# EasyEDA Pro project ProPrj_Smart_Screen_T113_end_2025-07-25.epro, board PCB
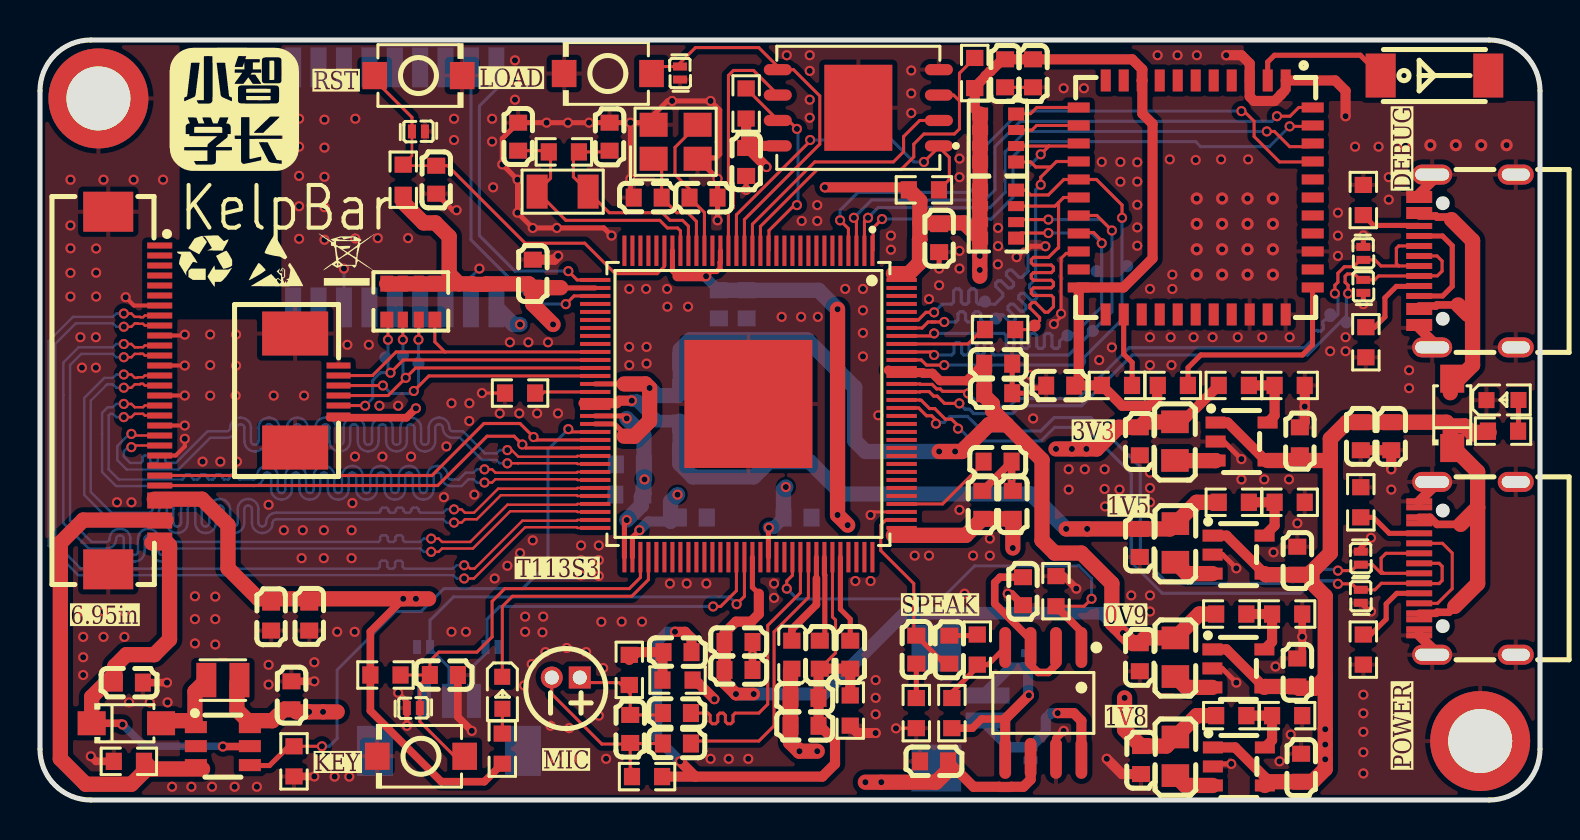
[diagram p7: board, top side]
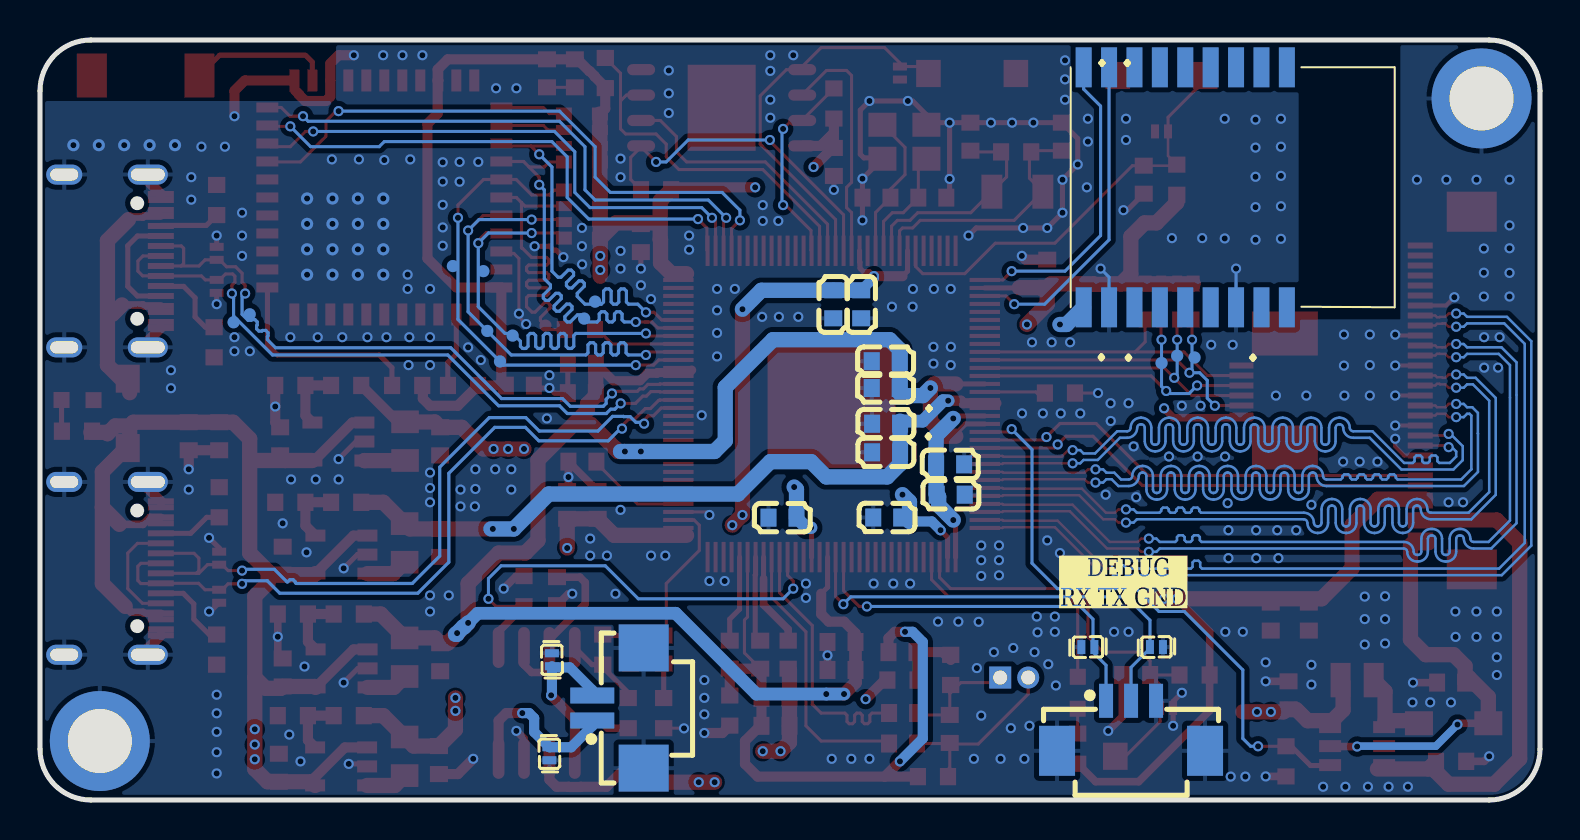
[diagram p8: board, bottom side, seen from below]

Outline 75 x 38 mm; copper layers: Top Layer, GND, VCC, Bottom Layer. Coordinates in mm from the lower left corner of the outline.
Outline path: 0,35.46 0,2.54 arc(0.74,0.74) 2.54,0 72.46,0 arc(74.26,0.74) 75,2.54 75,35.46 arc(74.26,37.26) 72.46,38 2.54,38 arc(0.74,37.26) 0,35.46
Stack: Top Layer 0.035mm 外层铜厚1oz / Dielectric1 0.2104mm 7628 RC49% 8.6mil / GND 0.0152mm 内层铜厚 / Dielectric2 1.065mm 1.1mm H/HOZ Copper / VCC 0.0152mm 内层铜厚 / Dielectric3 0.2104mm 7628 RC49% 8.6mil / Bottom Layer 0.035mm 外层铜厚1oz

## Design rules (mm)
net MIC_IN_3P: DP8
net MIC_IN_3N: DP8
net USB1_DP: DP1
net USB1_DM: DP1
net USB0_DM: DP2
net USB0_DP: DP2
net LCD_CLK_P: DP3
net LCD_CLK_N: DP3
net MIPI_0_P: DP10
net MIPI_0_N: DP10
net MIPI_1_P: DP11
net MIPI_1_N: DP11
net MIPI_2_P: DP12
net MIPI_2_N: DP12
net MIPI_3_P: DP13
net MIPI_3_N: DP13
template: 自定义配置
spacing copperThickness1oz (default): track to track 0.102, other pairs 0.152 to 0.3
spacing copperThickness2oz: track to track 0.203, other pairs 0.152 to 0.3
track width copperThickness1oz (default): min 0.127, default 0.254, max 2.54
track width copperThickness2oz: min 0.203, default 0.254, max 2.54
track width 3313_50ohm_单端: min 0.157, default 0.157, max 0.157
differential pair differentialPair (default): width min 0.127, default 0.127, max 2.54; gap min 0.152, default 0.203
differential pair 3313_100ohm_差分: width min 0.124, default 0.124, max 0.124; gap min 0.203, default 0.203
differential pair 3313_90ohm_差分: width min 0.157, default 0.157, max 0.157; gap min 0.203, default 0.203
via viaSize (default): diameter min 0.5, default 0.61, max 10; hole min 0.3, default 0.305, max 6.299
net WL_SDIO_D1 uses 3313_50ohm_单端
net WL_SDIO_D0 uses 3313_50ohm_单端
net WL_SDIO_CMD uses 3313_50ohm_单端
net WL_SDIO_D3 uses 3313_50ohm_单端
net WL_SDIO_D2 uses 3313_50ohm_单端
net WL_SDIO_CLK uses 3313_50ohm_单端
net USB1_DP uses 3313_90ohm_差分
net USB1_DM uses 3313_90ohm_差分
net USB0_DM uses 3313_90ohm_差分
net USB0_DP uses 3313_90ohm_差分
net LCD_CLK_P uses 3313_100ohm_差分
net LCD_CLK_N uses 3313_100ohm_差分
net MIPI_LCD_RST uses 3313_50ohm_单端
net MIPI_LCD_TE uses 3313_50ohm_单端
net MIPI_0_P uses 3313_100ohm_差分
net MIPI_0_N uses 3313_100ohm_差分
net MIPI_1_P uses 3313_100ohm_差分
net MIPI_1_N uses 3313_100ohm_差分
net MIPI_2_P uses 3313_100ohm_差分
net MIPI_2_N uses 3313_100ohm_差分
net MIPI_3_P uses 3313_100ohm_差分
net MIPI_3_N uses 3313_100ohm_差分
diff pair DP1 uses 3313_90ohm_差分
diff pair DP2 uses 3313_90ohm_差分
diff pair DP3 uses 3313_100ohm_差分
diff pair DP10 uses 3313_100ohm_差分
diff pair DP11 uses 3313_100ohm_差分
diff pair DP12 uses 3313_100ohm_差分
diff pair DP13 uses 3313_100ohm_差分

## Placement (name value [footprint] x y rotation side)
C1  100nF  [C0603]  35.31 31.9 270 top
C9  10uF  [C0603]  34.92 6.5 180 top
C12  100nF  [C0603]  34.92 7.9 180 top
C13  10uF  [C0603]  32.7 18.82 180 bottom
C14  100nF  [C0603]  32.7 17.38 180 bottom
C15  100nF  [C0603]  37.88 14.12 180 bottom
C16  100nF  [C0603]  32.64 14.12 180 bottom
C17  100nF  [C0603]  24.64 26.32 270 top
C19  100nF  [C0603]  44.96 28.09 90 top
C21  100nF  [C0603]  35.34 24.78 90 bottom
C27  10uF  [C0603]  32.71 20.6 180 bottom
C28  10uF  [C0603]  47.91 20.34 180 top
C29  100nF  [C0603]  32.71 21.94 180 bottom
C30  100nF  [C0603]  47.91 21.81 180 top
C31  10uF  [C0603]  38.23 5.11 180 top
C33  10uF  [C0603]  48.64 14.76 270 top
C34  100nF  [C0603]  47.12 14.76 270 top
C36  100nF  [C0603]  29.49 16.78 0 bottom
C37  100nF  [C0603]  29.46 15.27 0 bottom
C38  100nF  [C0603]  33.94 24.78 90 bottom
C41  100nF  [C0603]  19.81 31.02 90 top
C63  100nF  [C0603]  48.25 36.33 90 top
C64  10uF  [C0603]  49.65 36.33 90 top
C65  10uF  [C0603]  51.01 20.72 0 top
C82  470nF  [C0603]  40.51 7.27 270 top
C83  470nF  [C0603]  38.99 7.27 270 top
C85  100nF  [C0603]  31.85 4.35 0 top
C86  100nF  [C0603]  31.85 2.82 0 top
C87  100pF  [C0603]  29.51 3.55 90 top
C88  2.2uF  [C0603]  38.23 3.71 180 top
C91  100nF  [C0603]  47.88 16.92 180 top
C107  10uF  [C0603]  62.99 17.93 270 top
C108  10uF  [C0603]  54.99 17.93 90 top
C109  10uF  [C0603]  62.86 11.96 270 top
C110  10uF  [C0603]  54.99 12.85 90 top
C111  10uF  [C0603]  62.86 6.38 270 top
C112  10uF  [C0603]  54.99 7.14 90 top
C115  10uF  [C0603]  67.56 18.19 90 top
C116  100nF  [C0603]  66.04 18.19 90 top
C119  1uF  [C0603]  4.45 5.87 180 top
C120  12pF  [C0603]  28.48 33.17 90 top
C121  12pF  [C0603]  23.91 33.17 270 top
C122  12pF  [C0603]  30.38 30.12 0 top
C123  12pF  [C0603]  33.18 30.12 180 top
C124  100nF  [C0603]  20.19 6.25 180 top
C132  22uF  [C0603]  13.46 9.17 270 top
C133  1uF  [C0603]  11.56 9.17 90 top
C135  100nF  [C0603]  43.82 7.52 270 top
C138  1uF  [C0603]  49.15 10.44 90 top
C139  10uF  [C0603]  44.7 1.93 0 top
C141  1uF  [C0603]  12.57 5.23 270 top
C142  470nF  [C0603]  45.47 7.52 90 top
C143  10uF  [C0603]  31.88 7.39 0 top
C144  10uF  [C0603]  63.06 1.61 270 top
C145  10uF  [C0603]  55.05 2 90 top
CN2  HC-1.25-2PWT  [CONN-SMD_2P-P1.25-HC-1.25-2PWT]  46.1 4.6 90 bottom
D22  LMBR240FT1G  [SOD-123FL_L2.7-W1.8-LS3.8-RD]  4.32 3.84 0 top
D23  LMBR240FT1G  [SOD-123FL_L2.7-W1.8-LS3.8-RD]  70.61 19.33 90 top
FPC2  FPC-05F-30PH20  [FPC-SMD_30P-P0.50_XUNPU_FPC-05F-30PH20]  4.7 20.47 270 top
FPC7  AFC07-S06ECA-00  [FPC-SMD_P0.50-6P_LCS-SJ-H2.0]  13.84 20.47 90 top
L8  GZ1608D601TF  [L0603]  37.59 7.27 270 top
L10  AN2051-245  [ANT2051]  69.72 36.22 0 top
L18  10uH  [IND-SMD_L2.0-W1.6]  9.14 6 0 top
L20  2.2uH  [L0805]  56.75 17.94 90 top
L21  2.2uH  [L0805]  56.77 12.85 90 top
L22  2.2uH  [L0805]  56.77 2.19 90 top
L23  2.2uH  [L0805]  56.77 7.14 90 top
LED3  NCD0603B1  [LED0603-RD]  73.12 20 0 top
LED4  NCD0603B1  [LED0603-RD]  23.11 5.36 270 top
MIC2  GMI4015P-2C-42db  [MIC-TH_BD4.0-P1.40-D0.4-L-FD]  26.29 6.12 180 top
NOREF  -  [Pad_e3763]  52 21.93 0 top
NOREF#2  -  [Pad_e3756]  51.37 23.22 0 top
NOREF#3  -  [Pad_e3754]  47.24 24.92 0 top
NOREF#4  -  [Pad_e1455]  65.32 23.89 0 top
NOREF#5  -  [Pad_e1457]  52.83 26.44 0 top
NOREF#6  -  [Pad_e3755]  47.79 24.07 0 top
NOREF#7  -  [Pad_e1458]  17.27 22.12 0 top
NOREF#8  -  [Pad_e3757]  52.64 23.45 0 top
NOREF#9  -  [Pad_e1465]  18.92 21.85 0 top
NOREF#10  -  [Pad_e3765]  49.73 23.72 0 top
NOREF#11  -  [Pad_e1456]  54.36 26.7 0 top
NOREF#12  -  [Pad_e1459]  18.14 22.21 0 top
NOREF#13  -  [Pad_e12602]  72.01 2.95 180 top
NOREF#14  -  [Pad_e1454]  64.52 24.28 0 top
NOREF#15  -  [Pad_e12601]  2.92 35.08 180 top
R13  10kΩ  [R0603]  18.16 31.02 270 top
R14  10MΩ  [R0603]  26.19 32.4 0 top
R52  10kΩ  [R0603]  56.64 20.73 180 top
R79  0Ω  [R0603]  40.51 4.47 90 top
R90  33Ω  [R0603]  48.01 23.52 0 top
R91  10kΩ  [R0603]  53.85 20.73 180 top
R93  10kΩ  [R0603]  35.31 34.83 270 top
R107  150kΩ  [R0603]  62.48 20.73 180 top
R108  680kΩ  [R0603]  59.69 20.73 180 top
R109  300kΩ  [R0603]  59.69 14.89 180 top
R110  150kΩ  [R0603]  59.56 9.3 180 top
R111  200kΩ  [R0603]  62.48 14.89 180 top
R112  300kΩ  [R0603]  62.36 9.3 180 top
R113  5.1kΩ  [R0603]  66.17 7.52 90 top
R114  5.1kΩ  [R0603]  66.04 14.89 90 top
R115  10kΩ  [R0603]  73.15 18.44 0 top
R120  10kΩ  [R0603]  12.7 1.93 90 top
R121  10Ω  [R0603]  4.45 1.93 0 top
R122  10kΩ  [R0603]  44.2 30.51 180 top
R123  240Ω  [R0603]  24 20.35 0 top
R124  10kΩ  [R0603]  23.11 2.57 90 top
R126  10kΩ  [R0603]  17.27 6.25 180 top
R135  22Ω  [R0603]  43.82 4.34 90 top
R136  20kΩ  [R0603]  46.86 7.52 270 top
R138  100kΩ  [R0603]  50.8 10.44 270 top
R141  5.1kΩ  [R0603]  66.29 22.89 90 top
R142  5.1kΩ  [R0603]  66.17 30 90 top
R145  10kΩ  [R0603]  46.74 36.35 90 top
R146  1kΩ  [R0603]  30.35 1.17 180 top
R147  1kΩ  [R0603]  29.46 6.5 90 top
R148  75Ω  [R0603]  31.88 6 0 top
R149  20kΩ  [R0603]  45.59 4.34 270 top
R152  150kΩ  [R0603]  62.36 4.22 180 top
R153  300kΩ  [R0603]  59.56 4.22 180 top
RN1  10kΩ  [RES-ARRAY-SMD_0603-8P-L3.2-W1.6-BL]  18.54 24.92 0 top
RN2  10kΩ  [RES-ARRAY-SMD_0603-8P-L3.2-W1.6-BL]  47.9 33.1 90 top
RN3  10kΩ  [RES-ARRAY-SMD_0603-8P-L3.2-W1.6-BL]  47.9 29.29 90 top
SW1  TS-1088-AR02016  [SW-SMD_L3.9-W3.0-P4.45]  28.39 36.32 180 top
SW2  TS-1088-AR02016  [SW-SMD_L3.9-W3.0-P4.45]  18.92 36.22 0 top
SW5  TS-1088-AR02016  [SW-SMD_L3.9-W3.0-P4.45]  19.05 2.19 180 top
T1  T113_S3  [TQFP-128_L14.0-W14.0-P0.40-LS16.0-BL-EP6.4]  35.42 19.8 180 top
U1  W25N01GVZEIG  [WSON-8_L8.0-W6.10-P1.27-BL-EP]  40.92 34.61 90 top
U5  -  [MX02]  23.5 24.66 180 bottom
U11  RTL8723DS模块  [WIFIM-SMD_44P-L12.0-W12.0-P0.90_RTL8723DS]  57.79 30.13 270 top
U21  ESD5451N  [X1-DFN1006-2_L1.0-W0.6-P0.65-BI]  32 36.35 270 top
U24  ZX-MX1.25-3PWT  [CONN-SMD_3P-P1.25_MEGASTAR_ZX-MX1.25-3PWT]  20.45 3.71 180 bottom
U27  SY8088AAC  [SOT-23-5_L3.0-W1.7-P0.95-LS2.8-BR]  60.08 17.92 180 top
U28  SY8088AAC  [SOT-23-5_L3.0-W1.7-P0.95-LS2.8-BR]  59.93 12.27 180 top
U29  SY8088AAC  [SOT-23-5_L3.0-W1.7-P0.95-LS2.8-BR]  59.92 6.58 180 top
U33  ESD5451N  [X1-DFN1006-2_L1.0-W0.6-P0.65-BI]  66.17 27.33 270 top
U34  ESD5451N  [X1-DFN1006-2_L1.0-W0.6-P0.65-BI]  66.17 25.68 270 top
U35  ESD5451N  [X1-DFN1006-2_L1.0-W0.6-P0.65-BI]  66.04 10.19 90 top
U36  ESD5451N  [X1-DFN1006-2_L1.0-W0.6-P0.65-BI]  66.04 12.09 270 top
U37  ESD5451N  [X1-DFN1006-2_L1.0-W0.6-P0.65-BI]  19.18 7.65 0 bottom
U38  ESD5451N  [X1-DFN1006-2_L1.0-W0.6-P0.65-BI]  22.61 7.65 0 bottom
U41  ESD5451N  [X1-DFN1006-2_L1.0-W0.6-P0.65-BI]  18.92 33.43 180 top
U42  ESD5451N  [X1-DFN1006-2_L1.0-W0.6-P0.65-BI]  18.67 4.6 0 top
U49  ESD5451N  [X1-DFN1006-2_L1.0-W0.6-P0.65-BI]  49.4 7.01 270 bottom
U50  ESD5451N  [X1-DFN1006-2_L1.0-W0.6-P0.65-BI]  49.53 2.31 90 bottom
U52  MT9201  [SOT-23-6_L2.9-W1.6-P0.95-LS2.8-BR]  9.14 2.69 180 top
U53  LM4871  [SOIC-8_L4.9-W3.9-P1.27-LS6.0-BL]  50.17 4.85 180 top
U54  SY8088AAC  [SOT-23-5_L3.0-W1.7-P0.95-LS2.8-BR]  59.94 1.68 180 top
USB9  KH-TYPE-C-16P  [usb-c-smd_kh-type-c-16p]  71.37 11.58 90 top
USB10  KH-TYPE-C-16P  [usb-c-smd_kh-type-c-16p]  71.37 26.95 90 top
X1  XL2EL89COI-111YLC-24M  [CRYSTAL-SMD_4P-L3.2-W2.5-BL]  31.78 32.91 0 top
X2  32.768kHz  [OSC-SMD_L3.2-W1.5]  26.13 30.42 180 top

## Footprints (pads in the part's own frame, mm; a bottom-side part is the same pattern mirrored in y, then rotated)
ANT2051
  rect 1.5x2.2 smd: 1(-2.69,0) 2(2.69,0)
C0603
  rect 0.8x0.9 smd: 1(-0.7,0) 2(0.7,0)
CONN-SMD_2P-P1.25-HC-1.25-2PWT
  rect 0.8x2.2 smd: 1(-0.625,1.285) 2(0.625,1.285)
  rect 2.35x2.5 smd: 3(-3.005,-1.285) 4(3.005,-1.285)
CONN-SMD_3P-P1.25_MEGASTAR_ZX-MX1.25-3PWT
  rect 0.7x1.7 smd: 1(-1.25,1.25) 2(0,1.25) 3(1.25,1.25)
  rect 1.8x2.5 smd: 4(-3.7,-1.25) 5(3.7,-1.25)
CRYSTAL-SMD_4P-L3.2-W2.5-BL
  rect 1.4x1.2 smd: 1(-1.1,-0.85) 2(1.1,-0.85) 3(1.1,0.85) 4(-1.1,0.85)
FPC-SMD_30P-P0.50_XUNPU_FPC-05F-30PH20
  rect 0.3x1.25 smd: 1(-7.25,1.288) 2(-6.75,1.288) 3(-6.25,1.288) 4(-5.75,1.288) 5(-5.25,1.288) 6(-4.75,1.288) 7(-4.25,1.288) 8(-3.75,1.288) 9(-3.25,1.288) 10(-2.75,1.288) 11(-2.25,1.288) 12(-1.75,1.288) 13(-1.25,1.288) 14(-0.75,1.288) 15(-0.25,1.288) 16(0.25,1.288) 17(0.75,1.288) 18(1.25,1.288) 19(1.75,1.288) 20(2.25,1.288) 21(2.75,1.288) 22(3.25,1.288) 23(3.75,1.288) 24(4.25,1.288) 25(4.75,1.288) 26(5.25,1.288) 27(5.75,1.288) 28(6.25,1.288) 29(6.75,1.288) 30(7.25,1.288)
  rect 2x2.5 smd: 31(8.94,-1.288) 32(-8.94,-1.288)
FPC-SMD_P0.50-6P_LCS-SJ-H2.0
  rect 0.3x1.2 smd: 1(1.25,-1.085) 2(0.75,-1.085) 3(0.25,-1.085) 4(-0.25,-1.085) 5(-0.75,-1.085) 6(-1.25,-1.085)
  rect 2.2x3.3 smd: 7(2.85,1.085) 8(-2.85,1.085)
IND-SMD_L2.0-W1.6
  rect 1x1.72 smd: 1(0.828,0) 2(-0.828,0)
L0603
  rect 0.8x0.864 smd: 1(-0.7,0) 2(0.7,0)
L0805
  rect 1.133x1.377 smd: 1(-0.966,0) 2(0.966,0)
LED0603-RD
  rect 0.8x0.8 smd: 1(-0.799,-0.004) 2(0.799,0.004)
MIC-TH_BD4.0-P1.40-D0.4-L-FD
  rect 1.1x1.1 hole 0.7: 1(-0.7,0)
  round 1.1 hole 0.7: 2(0.7,0)
MX02
  rect 0.8x2 smd: 1(10.838,11.969) 2(9.568,11.969) 3(8.298,11.969) 4(7.028,11.969) 5(5.758,11.969) 6(4.488,11.969) 7(3.218,11.969) 8(1.948,11.969) 9(0.678,11.969) 10(0.678,-0.031) 11(1.948,-0.031) 12(3.218,-0.031) 13(4.488,-0.031) 14(5.758,-0.031) 15(7.028,-0.031) 16(8.298,-0.031) 17(9.568,-0.031) 18(10.838,-0.031)
OSC-SMD_L3.2-W1.5
  rect 1.05x1.7 smd: 1(-1.275,0) 2(1.275,0)
Pad_e1454
  round 0.61 smd far side: TP1(0,0)
Pad_e1455
  round 0.61 smd far side: TP2(0,0)
Pad_e1456
  round 0.61 smd far side: TP3(0,0)
Pad_e1457
  round 0.61 smd far side: TP4(0,0)
Pad_e1458
  round 0.61 smd far side: TP5(0,0)
Pad_e1459
  round 0.61 smd far side: TP6(0,0)
Pad_e1465
  round 0.61 smd far side: TP7(0,0)
Pad_e3754
  round 0.61 smd far side: TP22(0,0)
Pad_e3755
  round 0.61 smd far side: TP23(0,0)
Pad_e3756
  round 0.61 smd far side: TP24(0,0)
Pad_e3757
  round 0.61 smd far side: TP25(0,0)
Pad_e3763
  round 0.61 smd far side: TP26(0,0)
Pad_e3765
  round 0.61 smd: TP27(0,0)
Pad_e12601
  round 5 hole 3.2: 1(0,0)
Pad_e12602
  round 5 hole 3.2: 1(0,0)
R0603
  rect 0.806x0.864 smd: 1(-0.753,0) 2(0.753,0)
RES-ARRAY-SMD_0603-8P-L3.2-W1.6-BL
  rect 0.65x0.8 smd: 1(-1.2,-0.9) 4(1.2,-0.9) 5(1.2,0.9) 8(-1.2,0.9)
  rect 0.5x0.8 smd: 2(-0.4,-0.9) 3(0.4,-0.9) 6(0.4,0.9) 7(-0.4,0.9)
SOD-123FL_L2.7-W1.8-LS3.8-RD
  rect 1.4x1.2 smd: 1(-1.735,0) 2(1.735,0)
SOIC-8_L4.9-W3.9-P1.27-LS6.0-BL
  oval 0.588x2.045 smd: 1(-1.905,-2.772) 2(-0.635,-2.772) 3(0.635,-2.772) 4(1.905,-2.772) 5(1.905,2.772) 6(0.635,2.772) 7(-0.635,2.772) 8(-1.905,2.772)
SOT-23-5_L3.0-W1.7-P0.95-LS2.8-BR
  rect 1x0.6 smd: 1(1.3,-0.95) 2(1.3,0) 3(1.3,0.95) 4(-1.3,0.95) 5(-1.3,-0.95)
SOT-23-6_L2.9-W1.6-P0.95-LS2.8-BR
  rect 1.1x0.6 smd: 1(1.35,-0.95) 2(1.35,0) 3(1.35,0.95) 4(-1.35,0.95) 5(-1.35,0) 6(-1.35,-0.95)
SW-SMD_L3.9-W3.0-P4.45
  rect 1.23x1.36 smd: 1(-2.185,0) 2(2.185,0)
TQFP-128_L14.0-W14.0-P0.40-LS16.0-BL-EP6.4
  rect 0.2x1.52 smd: 1(-6.2,-7.66) 2(-5.8,-7.66) 3(-5.4,-7.66) 4(-5,-7.66) 5(-4.6,-7.66) 6(-4.2,-7.66) 7(-3.8,-7.66) 8(-3.4,-7.66) 9(-3,-7.66) 10(-2.6,-7.66) 11(-2.2,-7.66) 12(-1.8,-7.66) 13(-1.4,-7.66) 14(-1,-7.66) 15(-0.6,-7.66) 16(-0.2,-7.66) 17(0.2,-7.66) 18(0.6,-7.66) 19(1,-7.66) 20(1.4,-7.66) 21(1.8,-7.66) 22(2.2,-7.66) 23(2.6,-7.66) 24(3,-7.66) 25(3.4,-7.66) 26(3.8,-7.66) 27(4.2,-7.66) 28(4.6,-7.66) 29(5,-7.66) 30(5.4,-7.66) 31(5.8,-7.66) 32(6.2,-7.66) 65(6.2,7.66) 66(5.8,7.66) 67(5.4,7.66) 68(5,7.66) 69(4.6,7.66) 70(4.2,7.66) 71(3.8,7.66) 72(3.4,7.66) 73(3,7.66) 74(2.6,7.66) 75(2.2,7.66) 76(1.8,7.66) 77(1.4,7.66) 78(1,7.66) 79(0.6,7.66) 80(0.2,7.66) 81(-0.2,7.66) 82(-0.6,7.66) 83(-1,7.66) 84(-1.4,7.66) 85(-1.8,7.66) 86(-2.2,7.66) 87(-2.6,7.66) 88(-3,7.66) 89(-3.4,7.66) 90(-3.8,7.66) 91(-4.2,7.66) 92(-4.6,7.66) 93(-5,7.66) 94(-5.4,7.66) 95(-5.8,7.66) 96(-6.2,7.66)
  rect 1.52x0.2 smd: 33(7.66,-6.2) 34(7.66,-5.8) 35(7.66,-5.4) 36(7.66,-5) 37(7.66,-4.6) 38(7.66,-4.2) 39(7.66,-3.8) 40(7.66,-3.4) 41(7.66,-3) 42(7.66,-2.6) 43(7.66,-2.2) 44(7.66,-1.8) 45(7.66,-1.4) 46(7.66,-1) 47(7.66,-0.6) 48(7.66,-0.2) 49(7.66,0.2) 50(7.66,0.6) 51(7.66,1) 52(7.66,1.4) 53(7.66,1.8) 54(7.66,2.2) 55(7.66,2.6) 56(7.66,3) 57(7.66,3.4) 58(7.66,3.8) 59(7.66,4.2) 60(7.66,4.6) 61(7.66,5) 62(7.66,5.4) 63(7.66,5.8) 64(7.66,6.2) 97(-7.66,6.2) 98(-7.66,5.8) 99(-7.66,5.4) 100(-7.66,5) 101(-7.66,4.6) 102(-7.66,4.2) 103(-7.66,3.8) 104(-7.66,3.4) 105(-7.66,3) 106(-7.66,2.6) 107(-7.66,2.2) 108(-7.66,1.8) 109(-7.66,1.4) 110(-7.66,1) 111(-7.66,0.6) 112(-7.66,0.2) 113(-7.66,-0.2) 114(-7.66,-0.6) 115(-7.66,-1) 116(-7.66,-1.4) 117(-7.66,-1.8) 118(-7.66,-2.2) 119(-7.66,-2.6) 120(-7.66,-3) 121(-7.66,-3.4) 122(-7.66,-3.8) 123(-7.66,-4.2) 124(-7.66,-4.6) 125(-7.66,-5) 126(-7.66,-5.4) 127(-7.66,-5.8) 128(-7.66,-6.2)
  rect 6.4x6.4 smd: 129(0,0)
usb-c-smd_kh-type-c-16p
  oval 1x2 hole 0.6x1.7: 1(-4.32,1.765) 2(4.32,1.765)
  oval 1x1.8 hole 0.6x1.4: 3(-4.32,-2.415) 4(4.32,-2.415)
  rect 0.3x1.3 smd: A1(-3.35,2.415) A4(-2.55,2.415) A5(-1.25,2.415) A6(-0.25,2.415) A7(0.25,2.415) A8(1.25,2.415) A9(2.55,2.415) A12(3.35,2.415) B1(3.05,2.415) B4(2.25,2.415) B5(1.75,2.415) B6(0.75,2.415) B7(-0.75,2.415) B8(-1.75,2.415) B9(-2.25,2.415) B12(-3.05,2.415)
WIFIM-SMD_44P-L12.0-W12.0-P0.90_RTL8723DS
  rect 1.1x0.5 smd: 1(-5.85,4.5) 2(-5.85,3.6) 3(-5.85,2.7) 4(-5.85,1.8) 5(-5.85,0.9) 6(-5.85,0) 7(-5.85,-0.9) 8(-5.85,-1.8) 9(-5.85,-2.7) 10(-5.85,-3.6) 11(-5.85,-4.5) 23(5.85,-4.5) 24(5.85,-3.6) 25(5.85,-2.7) 26(5.85,-1.8) 27(5.85,-0.9) 28(5.85,0) 29(5.85,0.9) 30(5.85,1.8) 31(5.85,2.7) 32(5.85,3.6) 33(5.85,4.5)
  rect 0.5x1.1 smd: 12(-4.5,-5.85) 13(-3.6,-5.85) 14(-2.7,-5.85) 15(-1.8,-5.85) 16(-0.9,-5.85) 17(0,-5.85) 18(0.9,-5.85) 19(1.8,-5.85) 20(2.7,-5.85) 21(3.6,-5.85) 22(4.5,-5.85) 34(4.5,5.85) 35(3.6,5.85) 36(2.7,5.85) 37(1.8,5.85) 38(0.9,5.85) 39(0,5.85) 40(-0.9,5.85) 41(-1.8,5.85) 42(-2.7,5.85) 43(-3.6,5.85) 44(-4.5,5.85)
WSON-8_L8.0-W6.10-P1.27-BL-EP
  oval 0.56x1.4 smd: 1(-1.905,-4.027) 2(-0.635,-4.027) 3(0.635,-4.027) 4(1.905,-4.027) 5(1.905,4.027) 6(0.635,4.027) 7(-0.635,4.027) 8(-1.905,4.027)
  rect 4.3x3.4 smd: 9(0,0)
X1-DFN1006-2_L1.0-W0.6-P0.65-BI
  rect 0.4x0.7 smd: 1(-0.325,0) 2(0.325,0)

## Nets
As in the schematic, except:
GND: C1.2 C9.1 C12.1 C13.1 C14.1 C15.1 C16.1 C17.1 C19.1 C21.1 C27.1 C28.1 C29.1 C30.1 C33.1 C34.1 C36.1 C37.1 C38.1 C41.1 C63.1 C64.1 C65.1 C91.1 C107.1 C108.1 C109.1 C110.1 C111.1 C112.1 C115.1 C116.1 C119.1 C120.2 C121.1 C122.1 C123.1 C124.1 C132.2 C133.1 C138.1 C139.1 C141.1 C144.1 C145.1 CN2.3 CN2.4 FPC2.7 FPC2.10 FPC2.13 FPC2.16 FPC2.19 FPC2.22 FPC2.31 FPC2.32 FPC7.1 FPC7.7 FPC7.8 LED3.1 NOREF#13.1 NOREF#15.1 R79.1 R107.1 R111.1 R112.1 R113.1 R114.2 R120.1 R121.1 R123.1 R135.1 R138.1 R141.1 R142.2 R152.1 SW1.2 SW2.2 SW5.2 T1.99 T1.129 U1.4 U1.9 U5.11 U5.16 U11.1 U11.3 U11.20 U11.31 U11.33 U11.36 U21.2 U24.3 U24.4 U24.5 U27.2 U28.2 U29.2 U33.1 U34.2 U35.1 U36.1 U37.1 U38.2 U41.1 U42.1 U49.1 U50.1 U52.2 U53.7 U54.2 USB9.1 USB9.2 USB9.3 USB9.4 USB9.A1 USB9.A12 USB9.B1 USB9.B12 USB10.1 USB10.2 USB10.3 USB10.4 USB10.A1 USB10.A12 USB10.B1 USB10.B12 X1.2 X1.4
TP_RST: FPC7.5 NOREF#7.TP5 RN1.1 T1.43
TP_SCL: FPC7.4 NOREF#12.TP6 RN1.2 T1.44
TP_SDA: FPC7.3 NOREF#9.TP7 RN1.3 T1.45
USB0_DM: NOREF#4.TP2 T1.114 U34.1 USB10.A7 USB10.B7
USB0_DP: NOREF#14.TP1 T1.115 U33.2 USB10.A6 USB10.B6
WL_SDIO_CMD: NOREF.TP26 NOREF#11.TP3 RN3.4 T1.118 U11.16
WL_SDIO_D0: NOREF#8.TP25 RN3.2 T1.119 U11.18
WL_SDIO_D1: NOREF#2.TP24 NOREF#5.TP4 RN3.1 T1.121 U11.19
WL_SDIO_D2: NOREF#3.TP22 RN2.2 T1.123 U11.14
WL_SDIO_D3: NOREF#6.TP23 RN2.1 T1.122 U11.15
$2N981: NOREF#10.TP27 R90.2 RN3.3 U11.17

Pads without a net: FPC2 1 2 3 4 5 6 23; L10 2; T1 5 6 7 8 9 10 11 12 13 21 28 29 30 31 32 36 37 38 39 40 41 69 70 71 72 73 74 75 76 77 78 82 84 85 93 94 95 96 101 102 103 104 105 106 107 108 109 110 111 124 125 126 127; U5 1 2 3 4 5 6 7 12 13 14 15 17 18; U11 4 5 6 7 8 10 11 21 23 25 26 27 28 29 30 32 35 37 38 39 40; USB9 A8 B8; USB10 A8 B8

## Via types
v1: diameter 0.508, hole 0.305, Top Layer to Bottom Layer, 456 vias
v2: diameter 0.61, hole 0.305, Top Layer to Bottom Layer, 21 vias

## Routing (per net, layer and track width the routed paths; a pad name or vN(x,y) marks a point on that pad's centre or on a via; arc(x,y) is an arc through that point)
0V9: length 92.2
  Top Layer w0.254: 29.15,18.38 28.72,18.8 T1.51 ; T1.81 35.62,10.63 35.94,10.31 ; 29.21,20.8 T1.46
  Top Layer w0.457: C30.2 47.08,21.69 47.06,21.69 46.34,20.96 45,20.96 44.63,21.33 44.15,21.33 44.12,21.37 42.55,21.37 42.42,21.5
  Top Layer w0.508: 35.94,10.31 35.94,9.3 35.56,8.92 34.8,8.92 34.23,8.34 C12.2
  Top Layer w0.635: v1(35.69,5.3) v1(34.8,5.3) 34.23,5.87 C9.2 C12.2
  Top Layer w0.762: 48.33,18.77 47.44,18.77 46.58,17.9 46.56,17.9 46.25,17.59 46.25,17.57 46.1,17.43 v1(45.76,17.43) v1(44.96,17.43) ; 48.33,18.77 47.63,19.48 47.63,19.8 47.21,20.21 ; 48.33,18.77 50.1,17 50.1,12.98 50.74,12.35 52.07,12.35 53.59,10.82 v1(53.59,8.85) 54.61,7.84 C112.2 55.26,8.1 L23.2 57.96,9.3 R110.2 ; C28.2 C30.2 ; 29.21,18.19 29.72,18.19 30.48,18.95 v1(30.48,20.6) 30.28,20.8 29.21,20.8
  Bottom Layer w0.635: v1(53.59,8.85) 53.11,9.34 43.22,9.34 39.18,5.3 v1(35.69,5.3) v1(34.8,5.3)
  Bottom Layer w0.762: v1(53.59,8.85) 53.79,8.66 53.83,8.66 v1(54.14,8.34) 54.14,8.3 54.17,8.28 54.23,8.28 ; 45.97,17.43 v1(44.96,17.43) 41.27,17.43 40.74,17.96 40.74,20.63 38.35,23.01 32.51,23.01 32.01,22.51 C29.2 32.01,20.34 31.89,20.22 30.86,20.22 v1(30.48,20.6)
1V5: length 38
  Top Layer w0.508: v1(29.59,19.97) 28.96,19.97 28.83,19.84 27.18,19.84
  Top Layer w0.762: R109.2 57.83,14.89 56.5,13.55 C110.2 v1(52.36,13.55) v1(51.31,13.55)
  Bottom Layer w0.635: v1(29.59,19.97) 29.85,19.97 30.87,18.94 32,18.94
  Bottom Layer w0.762: 32,18.94 32,16.8 32.64,16.16 35.69,16.16 36.45,16.92 38.48,16.92 40.1,15.3 49.56,15.3 v1(51.31,13.55) 52.45,13.55
1V8: length 103.8
  Top Layer w0.254: 31.62,27.46 31.62,26.44 31.88,26.19 ; v1(29.34,14) 29.22,13.88 T1.65 ; T1.50 29.21,19.2 v1(29.34,19.08) ; v1(33.3,26.19) 33.54,26.42 33.84,26.42 34,26.59 34,26.89 34.02,26.91 T1.20
  Top Layer w0.508: v1(33.72,5.04) 32.66,6.1 32.5,6.1 ; 31.88,26.19 v1(33.3,26.19)
  Top Layer w0.762: v1(38.86,2.44) v1(37.97,2.44) 37.53,2.89 C88.2 C31.2 37.53,6.5 L8.2 ; v1(40.39,13.74) v1(39.88,14.25) v1(39.88,24.54) ; R153.2 57.83,4.22 56.31,2.7 C145.2 54.23,3.52 v1(54.23,4.46) v1(54.23,5.11) ; 42.67,13.23 46.29,13.23 C34.2 C33.2 v1(48.64,12.6)
  VCC w0.508: v1(37.97,2.44) 36.32,2.44 v1(33.72,5.04)
  VCC w0.762: 43.18,10.95 43.43,11.2 48.17,11.2 48.85,11.88 ; 43.18,10.95 40.89,8.66 40.89,3.39 39.94,2.44 v1(38.86,2.44) v1(37.97,2.44) ; 43.18,10.95 v1(40.39,13.74) v1(39.88,14.25) 39.62,14.5 32.64,14.5 32,13.87 30.73,13.87 30.2,14.41 30.2,16 v1(30.23,16.03) ; v1(54.23,5.11) 54.23,6.5 48.85,11.88 ; 48.85,11.88 48.64,12.09 v1(48.64,12.6)
  Bottom Layer w0.508: C38.2 33.3,26.12 v1(33.3,26.19)
  Bottom Layer w0.762: v1(29.34,14) 30.07,14.73 30.07,15.17 30.19,15.3 30.19,16.28 ; 30.19,16.28 30.23,16.25 v1(30.23,16.03) ; 30.19,16.28 C36.2 30.19,18.22 v1(29.34,19.08) ; C38.2 C21.2 38.93,25.48 v1(39.88,24.54)
3V3: length 212.3
  Top Layer w0.254: T1.83 36.42,13.59 v1(36.45,13.62) ; T1.34 26.05,25.6 26.04,25.62 ; v1(29.97,13.49) 29.62,13.14 T1.66
  Top Layer w0.381: v1(18.16,10.06) 16.52,8.42 R126.2 16.52,4.46 20.07,0.92 22.22,0.92 R124.1 ; 14.48,19.11 18.33,19.11 v1(18.8,19.58)
  Top Layer w0.508: v1(39.24,30.63) 43.32,30.63 R122.2 ; RN2.5 46.74,34.57 R145.1 46.74,35.64 47.27,36.18 47.27,36.2 47.51,36.44 47.53,36.44 48.13,37.03 C64.2 54.61,37.03 55.12,36.53 55.12,36.01 55.08,35.98 55.12,35.94 55.12,34.32 55.63,33.81 55.63,27.08 54.17,25.63 U11.22 51.94,20.94 51.72,20.73 ; R52.2 55.86,20.7 55.86,20.07 55.5,19.71 54.11,19.71 R91.2 51.72,20.73 ; v1(36.32,31.65) 35.37,32.6 C1.1 35.31,33.36 ; 51.72,20.73 C65.2 ; R108.2 57.11,18.9 56.77,18.9 ; 35.31,33.36 35.97,32.71 U1.8 ; 35.31,33.36 R93.2
  Top Layer w0.762: 17.34,25.82 17.35,25.81 20.95,25.81 ; 43.99,28.86 46.21,28.86 46.99,28.08 ; 43.99,28.86 43.99,28.03 43.97,28.02 43.97,26.86 43.43,26.32 42.67,26.32 ; 43.99,28.86 43.99,29.96 R122.2 ; C17.2 24.45,25.81 22.32,25.81 22.3,25.78 21.64,25.78 21.62,25.81 20.95,25.81 ; C17.2 24.64,24.79 v1(25.65,23.78) ; C17.2 26.04,25.62 ; 46.99,28.08 46.99,30.48 RN3.5 RN2.8 RN2.7 RN2.6 RN2.5 ; 46.99,28.08 RN3.8 ; 46.99,28.08 v1(46.99,27.2) v1(46.99,26.5) 46.99,26.19 ; 19.43,10.06 v1(18.79,10.06) v1(18.16,10.06) 10.92,10.06 9.4,11.58 9.4,13.74 8.1,15.04 5.72,15.04 ; R13.2 18.16,29.87 19.18,28.86 19.77,28.86 20.46,28.17 20.46,26.3 20.95,25.81 ; 56.77,18.9 55.26,18.9 C108.2 53.91,18.63 52.83,17.55 v1(52.32,17.55) v1(51.59,17.55) v1(50.8,17.55)
  VCC w0.508: 23.88,23.78 22.99,23.78 v1(18.8,19.58) ; v1(36.32,31.65) 37.34,30.63 v1(39.24,30.63)
  VCC w0.762: 32.51,15.65 32.26,15.65 v1(31.88,15.27) ; 32.51,15.65 32.59,15.65 ; 32.51,15.65 32,16.16 32,16.23 ; v1(18.16,10.06) v1(18.79,10.06) 23.11,10.06 26.04,12.98 26.04,15.39 27.69,17.05 31.19,17.05 32,16.23 ; v1(52.32,17.55) v1(51.59,17.55) v1(50.8,17.55) 49.51,17.55 48.89,18.18 ; 48.89,18.18 48.39,18.68 48.39,23.9 46.99,25.3 v1(46.99,26.5) v1(46.99,27.2) ; 48.89,18.18 46.36,15.65 v1(37.29,15.65) 32.59,15.65 ; 32.59,15.65 32,16.23 ; 32,16.23 32,22.38 30.61,23.78 v1(25.65,23.78) v1(24,23.78)
  Bottom Layer w0.508: 31.53,13.93 30.41,13.93 v1(29.97,13.49)
  Bottom Layer w0.635: v1(36.45,13.62) 36.68,13.62 C15.2
  Bottom Layer w0.762: v1(24,23.78) 23.67,23.78 U5.10 ; v1(31.88,15.27) 31.53,14.92 31.53,13.93 ; C15.2 37.18,15.53 v1(37.29,15.65)
5V: length 138.5
  Top Layer w0.381: USB9.A9 69.5,14.13 69.85,13.78 71.03,13.78 ; USB9.B9 69.8,9.33 69.85,9.39 70.45,9.39 70.74,9.68
  Top Layer w0.508: 61.29,16.97 59.39,18.87 58.78,18.87 ; U53.6 49.53,1.02 49.17,0.66 48.56,0.66 48.55,0.65 47.97,0.65 47.96,0.66 46.67,0.66 45.4,1.93 ; U29.1 59.32,7.53 U29.4 ; U54.1 59.76,2.63 61.24,1.14 U54.4 ; 61.23,11.32 59.33,13.22 U28.1
  Top Layer w0.762: U29.4 61.27,5.68 C111.2 62.96,5.58 63.72,5.58 64.26,6.12 ; 70.51,18.7 70.51,17.78 71.88,16.41 71.88,14.63 ; 70.51,18.7 71.24,18.7 71.63,18.31 71.7,18.38 72.46,18.38 ; 70.51,18.7 70.33,18.89 C115.2 C116.2 65.34,18.89 64.52,18.06 64.52,17.17 ; 62.73,16.97 64.32,16.97 64.52,17.17 ; 62.73,16.97 U27.4 ; 62.73,16.97 C107.2 ; v1(41.27,0.89) v1(42.06,0.89) 44.81,0.89 45.4,1.49 45.4,1.93 ; 64.26,6.12 v1(64.26,3.54) v1(64.26,2.77) v1(64.26,2.04) 64.26,1.55 63.62,0.91 C144.2 61.43,0.91 U54.4 ; 64.26,6.12 64.26,10.19 63.6,10.85 63.6,11.43 ; 14.86,4.41 v1(14.15,4.41) v1(13.46,4.41) 12.83,4.41 12.7,4.53 ; 64.52,17.17 64.52,12.35 63.6,11.43 ; 71.03,13.78 71.88,14.63 ; 71.88,14.63 71.88,10.82 70.74,9.68 ; 63.6,11.43 63.44,11.27 C109.2 61.28,11.27 U28.4 ; 9.84,5.87 9.84,4.5 10.38,3.96 11.62,3.96 12.19,4.53
  VCC w0.762: 13.42,4.41 v1(14.15,4.41) 14.86,4.41 18.38,0.89 v1(41.27,0.89) ; 64.26,3.71 v1(64.26,2.77) v1(64.26,2.04) 64.26,1.68 63.47,0.89 v1(42.06,0.89)
AGND: length 33.2
  Top Layer w0.152: C83.2 39.78,7.35 39.78,9 39.62,9.15 39.62,12.14 T1.91
  Top Layer w0.508: 32.77,1.17 39.12,1.17 39.75,1.8 39.75,2.95 38.99,3.71 C88.1 C31.1 38.93,6.5 C83.2 C82.2 R79.2 ; 32.77,1.17 R146.1 ; 32.77,1.17 v1(32,1.93) ; C143.2 32.58,8.09 32.26,8.41 v1(31.75,8.41)
  Bottom Layer w0.508: v1(32,1.93) 30.86,3.08 30.86,7.9 31.37,8.41 v1(31.75,8.41)
GND: length 114.9
  Top Layer w0.152: T1.99 41.68,14.4 v1(41.53,14.25) ; U11.20 51.84,27.33 51.31,27.33 51.05,27.08 v1(51.05,24.32) 51.05,24.16 v1(50.69,23.8) ; 43.56,3.59 42.81,3.59 v1(42.8,3.58) ; C63.1 C64.1 ; R123.1 v1(22.1,20.35)
  Top Layer w0.203: v1(7.24,23.27) 7.2,23.22 FPC2.10 ; FPC2.7 4.7,24.72 v1(4.28,25.14) ; FPC2.19 v1(7.24,18.72) ; FPC2.16 v1(7.24,20.22) ; FPC2.22 6.78,17.22 7.24,17.68 v1(7.24,18.06) ; FPC2.13 v1(7.24,21.72)
  Top Layer w0.254: v1(48.83,27.14) 49.18,27.49 49.32,27.49 49.52,27.69 v1(50.27,27.69) ; U35.1 66.48,9.42 v1(66.55,9.42) ; v1(29.52,33.87) v1(29.52,31.05) 29.52,30.28 C122.1 ; v1(29.52,33.87) 30.58,33.87 X1.4 30.68,34.26 31.37,34.95 v1(33.53,34.95) 33.98,34.49 33.98,32.28 33.81,32.11 32.92,32.11 X1.2 v1(33.88,31.07) C123.1 v1(33.88,28.98) ; v1(29.52,33.87) C120.2 v1(27.45,33.87) v1(26.4,33.87) v1(25.33,33.87) C121.1 23.11,33.07 v1(23.11,31.78) v1(23.88,31.02) v1(23.88,29.36) v1(24.64,28.6) v1(25.84,28.6) 28.19,28.6 v1(28.58,28.22) ; v1(18.34,3.71) U42.1 18.34,4.92 v1(17.91,5.36) ; v1(59.82,11.58) 59.13,12.27 U28.2 ; v1(59.82,5.87) 59.11,6.58 U29.2 ; U36.1 66.04,12.6 v1(66.55,13.11) ; 58.78,17.92 59.19,17.92 v1(60.07,17.05) ; C19.1 v1(44.96,26.57) ; v1(20.83,29.49) 20.64,29.49 C41.1 ; C65.1 50.19,20.6 v1(49.53,20.6) 49.27,20.34 C28.1 C30.1 ; U34.2 v1(66.17,24.79) ; v1(59.56,1.8) 58.77,1.8 U54.2 ; U33.1 v1(66.17,28.22) ; C1.2 v1(35.31,30.51)
  Top Layer w0.381: v1(48.39,10.31) 48.58,10.31 C138.1 ; v1(51.18,3.46) 50.8,3.08 U53.7 ; C33.1 48.58,15.52 v1(48.58,16.15) C91.1 47.12,15.46 C34.1 ; C124.1 20.89,4.15 v1(21.59,3.46) ; 12.7,5.93 v1(13.72,5.93) ; R121.1 2.79,1.93 v1(2.54,2.19) ; R120.1 v1(13.72,1.18) ; C9.1 v1(35.63,7.23) C12.1 ; C111.1 63.11,7.32 v1(63.11,8.16) R112.1 ; C119.1 v1(6.35,5.87) ; R138.1 51.19,11.19 v1(51.82,10.57)
  Top Layer w0.508: 68.96,8.23 69.61,7.58 USB9.1 ; 62.29,35.98 64.76,35.98 65.28,35.46 v1(65.28,34.19) ; USB9.A12 69.61,15.58 USB9.2 ; v1(25.91,27.2) 25.72,27.02 C17.1 ; C116.1 C115.1 v1(67.56,16.54) ; v1(59.31,37.24) 60.07,37.24 60.48,36.82 60.48,35.17 60.71,34.95 61.74,34.95 62.04,35.26 62.04,35.27 62.23,35.46 ; USB10.2 69.61,30.95 USB10.A12 ; R107.1 v1(63.24,19.67) 63.24,18.88 C107.1 ; C145.1 54.1,1.3 v1(53.34,2.06) ; USB10.A1 69.61,22.95 USB10.1 ; v1(41.78,3.35) 40.88,3.35 R79.1
  Bottom Layer w0.152: U5.11 21.55,26.15 v1(21.97,26.57) ; U5.16 v1(15.2,26.57)
  vias: v1(1.52,31.02) v1(1.52,28.73) v1(1.52,27.59) v1(1.52,26.35) v1(1.52,25.17) v1(2.02,23.14) v1(2.1,21.62) v1(2.16,9.42) v1(2.16,8.16) v1(2.16,7.14) v1(2.16,6.25) v1(2.81,27.57) v1(2.81,26.36) v1(2.81,25.17) v1(2.79,23.14) v1(2.79,21.62) v1(3.18,31.02) v1(3.18,9.42) v1(3.18,8.16) v1(3.85,14.89) v1(4.22,8.16) v1(4.23,9.42) v1(4.45,4.88) v1(4.57,14.89) v1(4.68,31.02) v1(5.49,4.88) v1(6.15,31.02) v1(6.38,4.88) v1(6.6,0.66) v1(7.57,0.66) v1(7.75,10.19) v1(7.75,9.04) v1(7.75,7.83) v1(8.13,16.92) v1(8.51,23.27) v1(8.51,21.74) v1(8.51,20.22) v1(8.6,0.66) v1(8.76,10.17) v1(8.76,9.04) v1(8.76,7.77) v1(9.02,16.92) v1(9.8,23.27) v1(9.8,21.72) v1(9.78,20.22) v1(9.73,0.66) v1(9.85,16.92) v1(10.84,0.66) v1(11.43,14.76) v1(11.43,6.76) v1(11.43,5.77) v1(11.68,20.22) v1(12.19,13.49) v1(12.95,34.06) v1(12.95,32.67) v1(12.95,31.21) v1(12.95,29.69) v1(12.95,28.06) v1(13.08,12.09) v1(13.2,20.22) v1(13.14,13.49) v1(13.72,6.88) v1(14.2,13.49) v1(14.19,12.09) v1(14.22,34.02) v1(14.22,32.62) v1(14.22,31.16) v1(14.22,29.64) v1(14.22,28.01) v1(14.73,1.17) v1(14.86,8.41) v1(15.37,22.76) v1(15.47,1.17) v1(15.62,14.84) v1(15.58,13.49) v1(15.58,12.09) v1(15.76,34.06) v1(15.76,28.08) v1(15.75,17.17) v1(15.73,8.41) v1(16.44,22.76) v1(16.89,28.09) v1(16.97,19.71) v1(17.12,17.17) v1(17.91,19.71) v1(18.41,28.09) v1(18.55,17.17) v1(20.19,15.14) v1(20.32,17.68) v1(20.57,19.84) v1(20.57,8.41) v1(20.7,34.06) v1(20.7,33) v1(21.3,8.41) v1(21.47,19.84) v1(21.46,18.95) v1(21.72,15.27) v1(22.61,34.06) v1(22.61,32.92) v1(22.66,30.63) v1(22.73,11.08) v1(22.99,19.33) v1(23.37,11.71) v1(23.5,22.89) v1(23.75,36.98) v1(23.75,36.03) v1(23.75,35.02) v1(23.96,19.33) v1(24,12.35) v1(24.21,5.73) v1(24.26,9.17) v1(24.26,8.41) v1(24.42,22.89) v1(24.59,6.79) v1(24.64,12.98) v1(24.86,19.33) v1(25.16,9.17) v1(25.12,8.38) v1(25.27,7.39) v1(25.4,22.89) v1(25.53,3.71) v1(25.78,2.06) v1(25.9,19.33) v1(26.34,7.6) v1(26.46,3.59) v1(26.97,2.06) v1(27.05,12.73) v1(27.05,11.99) v1(27.05,11.23) v1(27.3,7.39) v1(27.94,12.73) v1(27.94,11.99) v1(27.94,11.2) v1(27.94,4.22) v1(28.07,8.91) v1(28.16,6.6) v1(28.3,2.06) v1(29.08,8.92) v1(29.46,25.55) v1(29.46,22.66) v1(29.46,21.74) v1(30.1,8.92) v1(30.31,25.55) v1(30.33,22.66) v1(30.33,21.82) v1(31.35,25.55) v1(31.37,24.66) v1(31.5,10.82) v1(31.61,34.95) v1(32.4,24.66) v1(32.34,10.82) v1(33.32,10.82) v1(33.53,2.06) v1(34.44,2.06) v1(35.41,2.06) v1(36.7,10.82) v1(36.7,10.11) v1(37.08,24.16) v1(37.34,37.24) v1(38.08,28.95) v1(38.05,24.16) v1(38.49,37.24) v1(38.49,36.46) v1(38.49,35.02) v1(38.49,34.11) v1(38.86,29.74) v1(38.86,28.95) v1(38.89,24.16) v1(40.26,25.55) v1(40.77,10.95) v1(41.15,25.55) v1(41.15,24.48) v1(41.15,23.35) v1(41.15,22.18) v1(41.53,10.95) v1(41.78,6) v1(41.78,5.11) v1(41.78,4.28) v1(41.92,19.24) v1(42.55,28.22) v1(42.55,27.52) v1(43.56,36.48) v1(43.56,35.33) v1(43.56,34.35) v1(43.73,12.22) v1(44.45,25.05) v1(44.45,12.22) v1(44.96,25.74) v1(45.97,32.07) v1(45.97,31.14) v1(45.97,27.46) v1(45.97,26.57) v1(45.97,14.5) v1(46.23,10.31) v1(46.65,12.22) v1(47.49,13.07) v1(47.49,12.22) v1(47.9,28.6) v1(47.9,27.69) v1(47.89,26.78) v1(49.53,21.24) v1(49.66,19.08) v1(51.18,35.59) v1(51.44,16.54) v1(51.44,15.52) v1(52.2,35.59) v1(52.24,16.54) v1(52.96,22) v1(53.09,31.9) v1(53.23,16.54) v1(53.23,15.55) v1(53.26,14.68) v1(53.59,22.63) v1(54.02,31.9) v1(54.02,30.91) v1(53.98,15.52) v1(53.98,14.68) v1(54.56,10.23) v1(54.86,31.89) v1(54.86,30.92) v1(54.86,29.76) v1(54.86,28.63) v1(54.86,27.71) v1(55.5,25.55) v1(55.5,23.14) v1(55.5,21.74) v1(55.5,16.37) v1(55.5,15.6) v1(55.5,14.89) v1(55.5,10.23) v1(55.5,9.42) v1(55.88,37.24) v1(56.49,32.03) v1(56.62,26.27) v1(56.62,25.55) v1(56.53,23.14) v1(56.57,21.74) v1(56.88,37.24) v1(57.68,23.14) v1(57.79,32) v1(57.84,37.24) v1(58.63,23.14) v1(59.05,32.03) v1(59.89,23.14) v1(60.07,16.03) v1(60.41,32.03) v1(61.11,23.14) v1(61.21,16.03) v1(61.67,12.38) v1(61.77,6.67) v1(61.98,1.93) v1(62.48,23.14) v1(62.45,16.03) v1(62.54,3.27) v1(62.87,13.83) v1(64.51,22.44) v1(64.9,29.36) v1(64.9,28.22) v1(64.9,27.2) v1(65.28,23.14) v1(65.28,22.44) v1(65.75,32.67) v1(66.17,5.26) v1(66.17,4.34) v1(66.17,3.41) v1(66.17,2.39) v1(66.17,1.33) v1(66.93,32.67) v1(67.44,31.14) v1(67.44,30.02) v1(67.56,15.52) v1(68.45,21.49) v1(68.45,20.59) v2(57.84,30.08) v2(57.84,28.8) v2(57.84,27.53) v2(57.84,26.27) v2(59.11,30.08) v2(59.11,28.8) v2(59.11,27.53) v2(59.11,26.27) v2(60.38,30.08) v2(60.38,28.8) v2(60.38,27.53) v2(60.38,26.27) v2(61.65,30.08) v2(61.65,28.8) v2(61.65,27.53) v2(61.65,26.27) v2(68.25,32.74) v2(69.52,32.74) v2(70.79,32.74) v2(72.06,32.74) v2(73.33,32.74)
VIN5V: length 13.8
  Top Layer w0.381: 70.9,24.75 69.85,24.75 69.8,24.7 USB10.B9 ; USB10.B4 69.8,29.2 69.85,29.15 70.57,29.15
  Top Layer w0.762: 70.52,20.36 70.52,20.63 71.63,21.74 71.63,27.97 70.57,29.02 ; 70.9,24.75 71.37,24.28
(no net): length 11.3
  Top Layer w0.152: USB9.A8 70.12,12.83 70.61,12.35 70.61,10.57 69.88,9.83 USB9.B8
  Top Layer w0.254: USB10.A8 70.12,28.2 70.61,27.71 70.61,25.68 70.13,25.2 USB10.B8
BTN1: length 21.5
  Top Layer w0.152: C124.2 R126.1 ; C124.2 19.49,6.95 19.94,7.39 21.84,7.39 22.61,8.16 22.61,9.93 23.24,10.57 29.46,10.57 30.02,11.13 T1.67 ; C124.2 18.99,5.75 18.99,3.92 20.73,2.19
DXIN: length 5.8
  Top Layer w0.152: T1.23 32.82,28.93 32.39,29.36 31.84,29.36 C122.2 31.08,31.66 X1.1
DXOUT: length 7.4
  Top Layer w0.152: X1.3 31.75,32.63 31.75,31.27 32.48,30.54 C123.2 33.22,29.37 T1.22
HPOUT_FB: length 5
  Top Layer w0.152: T1.100 45.13,14.8 47.18,16.85 C91.2
HPOUTR: length 9.8
  Top Layer w0.152: 43.69,8.16 43.69,10.82 42.04,12.47 42.04,13.74 42.3,14 T1.98 ; 43.56,8.09 43.69,8.09
  Top Layer w0.254: C135.1 45.22,6.82 C142.1
LCD_CLK_N: length 44.2
  Top Layer w0.124: v1(20.7,13.87) 21.08,13.87 21.25,14.04 21.84,14.04 23.04,15.24 26.84,15.24 26.88,15.2 T1.60 ; FPC2.14 5.24,21.22 5.15,21.14 4.89,21.14 4.86,21.11 4.74,21.11 4.57,21.28 v1(4.19,21.28)
  Bottom Layer w0.124: v1(4.19,21.28) 3.81,21.28 3.65,21.11 3.22,21.11 2.21,20.1 2.21,15.26 3.43,14.04 5.46,14.04 arc(5.81,14.18) 5.96,14.54 arc(6.02,14.67) 6.14,14.72 6.16,14.72 arc(6.29,14.67) 6.34,14.54 6.34,13.86 arc(6.49,13.5) 6.85,13.35 6.87,13.35 arc(7.23,13.5) 7.38,13.86 7.38,14.54 arc(7.43,14.67) 7.56,14.72 7.58,14.72 arc(7.71,14.67) 7.76,14.54 7.76,13.86 arc(7.91,13.5) 8.27,13.35 8.29,13.35 arc(8.65,13.5) 8.8,13.86 8.8,14.54 arc(8.85,14.67) 8.98,14.72 9,14.72 arc(9.13,14.67) 9.18,14.54 9.18,13.86 arc(9.33,13.5) 9.69,13.35 9.71,13.35 arc(10.07,13.5) 10.21,13.86 10.21,14.54 arc(10.27,14.67) 10.39,14.72 10.42,14.72 arc(10.54,14.67) 10.6,14.54 10.6,13.86 arc(10.74,13.5) 11.1,13.35 11.13,13.35 arc(11.48,13.5) 11.63,13.86 arc(11.68,13.98) 11.81,14.04 20.16,14.04 20.32,13.87 v1(20.7,13.87)
LCD_CLK_P: length 44.1
  Top Layer w0.124: FPC2.15 5.24,20.72 5.15,20.81 5.03,20.81 5,20.78 4.74,20.78 4.57,20.61 v1(4.19,20.61) ; T1.59 26.88,15.6 26.84,15.57 22.91,15.57 21.7,14.36 21.25,14.36 21.08,14.53 v1(20.7,14.53)
  Bottom Layer w0.124: v1(4.19,20.61) 3.81,20.61 3.65,20.78 3.36,20.78 2.54,19.97 2.54,15.39 3.57,14.36 5.46,14.36 arc(5.58,14.42) 5.64,14.54 arc(5.78,14.9) 6.14,15.05 6.16,15.05 arc(6.52,14.9) 6.67,14.54 6.67,13.86 arc(6.72,13.73) 6.85,13.68 6.87,13.68 arc(7,13.73) 7.05,13.86 7.05,14.54 arc(7.2,14.9) 7.56,15.05 7.58,15.05 arc(7.94,14.9) 8.09,14.54 8.09,13.86 arc(8.14,13.73) 8.27,13.68 8.29,13.68 arc(8.42,13.73) 8.47,13.86 8.47,14.54 arc(8.62,14.9) 8.98,15.05 9,15.05 arc(9.36,14.9) 9.51,14.54 9.51,13.86 arc(9.56,13.73) 9.69,13.68 9.71,13.68 arc(9.83,13.73) 9.89,13.86 9.89,14.54 arc(10.04,14.9) 10.39,15.05 10.42,15.05 arc(10.78,14.9) 10.92,14.54 10.92,13.86 arc(10.98,13.73) 11.1,13.68 11.13,13.68 arc(11.25,13.73) 11.3,13.86 arc(11.45,14.22) 11.81,14.36 16.95,14.36 17.04,14.45 17.04,14.53 17.12,14.62 17.33,14.62 17.42,14.53 17.42,14.45 17.5,14.36 17.71,14.36 17.8,14.45 17.8,14.53 17.89,14.62 18.09,14.62 18.18,14.53 18.18,14.45 18.27,14.36 18.47,14.36 18.56,14.45 18.56,14.53 18.65,14.62 18.85,14.62 18.94,14.53 18.94,14.45 19.03,14.36 20.16,14.36 20.32,14.53 v1(20.7,14.53)
LCD_PWM: length 29.7
  Top Layer w0.152: R120.2 v1(14.1,2.69) ; v1(26.42,18.54) 26.56,18.4 T1.52
  Top Layer w0.254: R120.2 12.44,2.69 11.48,1.72 10.47,1.72
  Bottom Layer w0.152: v1(26.42,18.54) 25.4,17.53 25.4,11.84 24.13,10.57 20.19,10.57 19.05,9.42 17.78,9.42 14.86,6.5 14.86,3.08 14.47,2.69 v1(14.1,2.69)
LED1: length 12.5
  Top Layer w0.152: LED4.1 23.11,6.16 23.11,9.68 23.62,10.19 29.59,10.19 30.42,11.02 T1.68
LEDA: length 20.9
  Top Layer w0.381: D22.1 4.06,3.84 v1(4.13,3.77) ; 10.47,2.67 v1(9.14,2.67)
  Top Layer w0.762: 3.75,6.12 3.75,6.69 4.32,7.27 5.72,7.27 6.48,8.03 6.48,12.73 6.35,12.85 5.59,12.85 ; 3.75,6.12 3.56,6.12 2.58,5.15 2.58,3.96 ; 3.75,6.12 C119.2
  Bottom Layer w0.381: v1(9.14,2.67) 9.12,2.69 5.21,2.69 v1(4.13,3.77)
LEDK: length 25.1
  Top Layer w0.762: 8.13,1.55 5.58,1.55 R121.2 5.2,1.42 4.57,0.79 2.29,0.79 1.02,2.06 1.02,12.85 2.16,14 6.31,14
MIC_IN_3N: length 13.7
  Top Layer w0.152: C86.2 32.67,2.95 35.94,2.95 36.7,3.71 36.7,8.41 38.42,10.13 T1.88
MIC_IN_3P: length 13.7
  Top Layer w0.152: T1.87 38.02,10.36 36.39,8.73 36.39,4.79 35.94,4.34 34.76,4.34 34.65,4.24 34.65,3.92 34.54,3.81 34.38,3.81 34.27,3.92 34.27,4.24 34.16,4.34 34,4.34 33.89,4.24 33.89,3.92 33.78,3.81 33.61,3.81 33.51,3.92 33.51,4.24 33.4,4.34 32.55,4.34 C85.2
MIPI_0_N: length 44.1
  Top Layer w0.124: FPC2.20 4.65,18.22 v1(4.57,18.3) ; T1.56 26.88,16.8 26.84,16.84 23.91,16.84 23.91,16.83 v1(23.37,16.83)
  Bottom Layer w0.124: v1(23.37,16.83) 22.99,16.83 22.82,17 22.11,17 21,18.11 20.64,18.11 arc(20.29,18.26) 20.14,18.61 arc(20.09,18.73) 19.97,18.79 19.94,18.79 arc(19.81,18.73) 19.76,18.61 19.76,17.94 arc(19.61,17.58) 19.26,17.43 19.23,17.43 arc(18.87,17.58) 18.73,17.94 18.73,18.61 arc(18.67,18.73) 18.55,18.79 18.52,18.79 arc(18.4,18.73) 18.34,18.61 18.34,17.94 arc(18.2,17.58) 17.84,17.43 17.81,17.43 arc(17.45,17.58) 17.31,17.94 17.31,18.61 arc(17.26,18.73) 17.13,18.79 17.1,18.79 arc(16.98,18.73) 16.93,18.61 16.93,17.94 arc(16.78,17.58) 16.42,17.43 16.39,17.43 arc(16.04,17.58) 15.89,17.94 15.89,18.61 arc(15.84,18.73) 15.72,18.79 15.68,18.79 arc(15.56,18.73) 15.51,18.61 15.51,17.94 arc(15.36,17.58) 15.01,17.43 14.98,17.43 arc(14.62,17.58) 14.47,17.94 14.47,18.61 arc(14.42,18.73) 14.3,18.79 14.27,18.79 arc(14.14,18.73) 14.09,18.61 14.09,17.94 arc(13.94,17.58) 13.59,17.43 13.56,17.43 arc(13.2,17.58) 13.06,17.94 13.06,18.61 arc(13,18.73) 12.88,18.79 12.85,18.79 arc(12.73,18.73) 12.67,18.61 12.67,17.94 arc(12.53,17.58) 12.17,17.43 12.14,17.43 arc(11.79,17.58) 11.64,17.94 11.64,18.61 arc(11.59,18.73) 11.46,18.79 11.43,18.79 arc(11.31,18.73) 11.26,18.61 11.26,17.94 arc(11.11,17.58) 10.76,17.43 10.72,17.43 arc(10.37,17.58) 10.22,17.94 10.22,18.61 arc(10.17,18.73) 10.05,18.79 10.01,18.79 arc(9.89,18.73) 9.84,18.61 arc(9.69,18.26) 9.34,18.11 8.51,18.11 6.93,16.53 4.33,16.53 3.86,16.99 3.86,17.69 4.48,18.3 v1(4.57,18.3)
MIPI_0_P: length 43.9
  Top Layer w0.124: FPC2.21 4.65,17.72 v1(4.57,17.64) ; v1(23.37,17.49) 23.58,17.49 23.91,17.17 26.84,17.17 26.88,17.2 T1.55
  Bottom Layer w0.124: v1(23.37,17.49) 22.99,17.49 22.82,17.33 22.25,17.33 21.14,18.44 20.64,18.44 arc(20.52,18.49) 20.47,18.61 arc(20.32,18.97) 19.97,19.11 19.94,19.11 arc(19.58,18.97) 19.43,18.61 19.43,17.94 arc(19.38,17.81) 19.26,17.76 19.23,17.76 arc(19.1,17.81) 19.05,17.94 19.05,18.61 arc(18.91,18.97) 18.55,19.11 18.52,19.11 arc(18.16,18.97) 18.02,18.61 18.02,17.94 arc(17.96,17.81) 17.84,17.76 17.81,17.76 arc(17.69,17.81) 17.64,17.94 17.64,18.61 arc(17.49,18.97) 17.13,19.11 17.1,19.11 arc(16.75,18.97) 16.6,18.61 16.6,17.94 arc(16.55,17.81) 16.42,17.76 16.39,17.76 arc(16.27,17.81) 16.22,17.94 16.22,18.61 arc(16.07,18.97) 15.72,19.11 15.68,19.11 arc(15.33,18.97) 15.18,18.61 15.18,17.94 arc(15.13,17.81) 15.01,17.76 14.98,17.76 arc(14.85,17.81) 14.8,17.94 14.8,18.61 arc(14.65,18.97) 14.3,19.11 14.27,19.11 arc(13.91,18.97) 13.76,18.61 13.76,17.94 arc(13.71,17.81) 13.59,17.76 13.56,17.76 arc(13.43,17.81) 13.38,17.94 13.38,18.61 arc(13.24,18.97) 12.88,19.11 12.85,19.11 arc(12.49,18.97) 12.35,18.61 12.35,17.94 arc(12.3,17.81) 12.17,17.76 12.14,17.76 arc(12.02,17.81) 11.97,17.94 11.97,18.61 arc(11.82,18.97) 11.46,19.11 11.43,19.11 arc(11.08,18.97) 10.93,18.61 10.93,17.94 arc(10.88,17.81) 10.76,17.76 10.72,17.76 arc(10.6,17.81) 10.55,17.94 10.55,18.61 arc(10.4,18.97) 10.05,19.11 10.01,19.11 arc(9.66,18.97) 9.51,18.61 arc(9.46,18.49) 9.34,18.44 8.38,18.44 6.79,16.85 6.36,16.85 6.27,16.94 6.27,17.14 6.18,17.22 5.98,17.22 5.89,17.14 5.89,16.94 5.8,16.85 5.6,16.85 5.51,16.94 5.51,17.14 5.42,17.22 5.22,17.22 5.13,17.14 5.13,16.94 5.04,16.85 4.51,16.85 4.19,17.17 4.19,17.43 4.41,17.64 v1(4.57,17.64)
MIPI_1_N: length 44.9
  Top Layer w0.124: FPC2.17 5.24,19.72 5.15,19.64 4.74,19.64 4.57,19.8 v1(4.19,19.8) ; T1.58 26.88,16 26.84,16.04 22.77,16.04 22.6,15.87 v1(22.23,15.87)
  Bottom Layer w0.124: v1(4.19,19.8) 3.81,19.8 3.65,19.64 3.39,19.64 3.11,19.36 3.11,18.33 3.1,18.32 3.1,16.4 3.8,15.7 10.68,15.7 arc(11.03,15.84) 11.18,16.2 arc(11.23,16.32) 11.35,16.37 11.38,16.37 arc(11.51,16.32) 11.56,16.2 11.56,15.52 arc(11.7,15.17) 12.06,15.02 12.09,15.02 arc(12.45,15.17) 12.59,15.52 12.59,16.2 arc(12.64,16.32) 12.77,16.37 12.8,16.37 arc(12.92,16.32) 12.97,16.2 12.97,15.52 arc(13.12,15.17) 13.48,15.02 13.51,15.02 arc(13.86,15.17) 14.01,15.52 14.01,16.2 arc(14.06,16.32) 14.18,16.37 14.22,16.37 arc(14.34,16.32) 14.39,16.2 14.39,15.52 arc(14.54,15.17) 14.89,15.02 14.93,15.02 arc(15.28,15.17) 15.43,15.52 15.43,16.2 arc(15.48,16.32) 15.6,16.37 15.64,16.37 arc(15.76,16.32) 15.81,16.2 15.81,15.52 arc(15.96,15.17) 16.31,15.02 16.34,15.02 arc(16.7,15.17) 16.85,15.52 16.85,16.2 arc(16.9,16.32) 17.02,16.37 17.05,16.37 arc(17.18,16.32) 17.23,16.2 17.23,15.52 arc(17.37,15.17) 17.73,15.02 17.76,15.02 arc(18.12,15.17) 18.26,15.52 18.26,16.2 arc(18.31,16.32) 18.44,16.37 18.47,16.37 arc(18.59,16.32) 18.64,16.2 18.64,15.52 arc(18.79,15.17) 19.15,15.02 19.18,15.02 arc(19.53,15.17) 19.68,15.52 19.68,16.2 arc(19.73,16.32) 19.85,16.37 19.89,16.37 arc(20.01,16.32) 20.06,16.2 arc(20.21,15.85) 20.56,15.7 21.08,15.7 21.42,16.04 21.68,16.04 21.85,15.87 v1(22.23,15.87)
MIPI_1_P: length 45
  Top Layer w0.124: FPC2.18 5.24,19.22 5.15,19.31 4.74,19.31 4.57,19.14 v1(4.19,19.14) ; v1(22.23,16.53) 22.6,16.53 22.77,16.37 26.84,16.37 26.88,16.4 T1.57
  Bottom Layer w0.124: v1(22.23,16.53) 21.85,16.53 21.68,16.37 21.28,16.37 20.94,16.03 20.56,16.03 arc(20.44,16.08) 20.39,16.2 arc(20.24,16.55) 19.89,16.7 19.85,16.7 arc(19.5,16.55) 19.35,16.2 19.35,15.52 arc(19.3,15.4) 19.18,15.35 19.15,15.35 arc(19.02,15.4) 18.97,15.52 18.97,16.2 arc(18.82,16.55) 18.47,16.7 18.44,16.7 arc(18.08,16.55) 17.94,16.2 17.94,15.52 arc(17.88,15.4) 17.76,15.35 17.73,15.35 arc(17.6,15.4) 17.55,15.52 17.55,16.2 arc(17.41,16.55) 17.05,16.7 17.02,16.7 arc(16.66,16.55) 16.52,16.2 16.52,15.52 arc(16.47,15.4) 16.34,15.35 16.31,15.35 arc(16.19,15.4) 16.14,15.52 16.14,16.2 arc(15.99,16.55) 15.64,16.7 15.6,16.7 arc(15.25,16.55) 15.1,16.2 15.1,15.52 arc(15.05,15.4) 14.93,15.35 14.89,15.35 arc(14.77,15.4) 14.72,15.52 14.72,16.2 arc(14.57,16.55) 14.22,16.7 14.18,16.7 arc(13.83,16.55) 13.68,16.2 13.68,15.52 arc(13.63,15.4) 13.51,15.35 13.48,15.35 arc(13.35,15.4) 13.3,15.52 13.3,16.2 arc(13.16,16.55) 12.8,16.7 12.77,16.7 arc(12.41,16.55) 12.27,16.2 12.27,15.52 arc(12.22,15.4) 12.09,15.35 12.06,15.35 arc(11.94,15.4) 11.89,15.52 11.89,16.2 arc(11.74,16.55) 11.38,16.7 11.35,16.7 arc(11,16.55) 10.85,16.2 arc(10.8,16.08) 10.68,16.03 9.96,16.03 9.88,16.11 9.88,16.19 9.79,16.28 9.58,16.28 9.5,16.19 9.5,16.11 9.41,16.03 9.2,16.03 9.11,16.11 9.11,16.19 9.03,16.28 8.82,16.28 8.73,16.19 8.73,16.11 8.65,16.03 8.44,16.03 8.35,16.11 8.35,16.19 8.26,16.28 8.06,16.28 7.97,16.19 7.97,16.11 7.88,16.03 7.68,16.03 7.59,16.11 7.59,16.19 7.5,16.28 7.3,16.28 7.21,16.19 7.21,16.11 7.12,16.03 3.94,16.03 3.43,16.54 3.43,16.54 3.43,19.22 3.52,19.31 3.65,19.31 3.81,19.14 v1(4.19,19.14)
MIPI_2_N: length 45.2
  Top Layer w0.124: v1(4.19,22.8) 4.57,22.8 4.74,22.63 4.89,22.63 4.89,22.64 5.15,22.64 5.24,22.72 FPC2.11 ; v1(19.56,12.41) 19.94,12.41 20.1,12.58 21.65,12.58 23.51,14.44 26.84,14.44 26.88,14.4 T1.62
  Bottom Layer w0.124: v1(19.56,12.41) 19.18,12.41 19.01,12.58 6.8,12.58 arc(6.69,12.53) 6.64,12.41 arc(6.5,12.07) 6.15,11.93 6.09,11.93 arc(5.75,12.07) 5.61,12.41 5.61,13.06 arc(5.56,13.18) 5.45,13.23 5.39,13.23 arc(5.27,13.18) 5.23,13.06 5.23,12.41 arc(5.08,12.07) 4.74,11.93 4.68,11.93 arc(4.33,12.07) 4.19,12.41 4.19,13.06 arc(4.14,13.18) 4.03,13.23 3.97,13.23 arc(3.86,13.18) 3.81,13.06 arc(3.67,12.72) 3.32,12.58 2.44,12.58 1.17,13.84 1.17,20.25 ; v1(4.19,22.8) 3.81,22.8 3.65,22.63 1.93,22.63 1.17,21.88 1.17,20.25
MIPI_2_P: length 45
  Top Layer w0.124: v1(4.19,22.14) 4.57,22.14 4.74,22.31 5.02,22.31 5.03,22.31 5.15,22.31 5.24,22.22 FPC2.12 ; T1.61 26.88,14.8 26.84,14.77 23.38,14.77 21.51,12.9 20.1,12.9 19.94,13.07 v1(19.56,13.07)
  Bottom Layer w0.124: v1(4.19,22.14) 3.81,22.14 3.65,22.31 2.06,22.31 1.5,21.75 1.5,20.12 1.5,13.97 2.57,12.9 3.32,12.9 arc(3.44,12.95) 3.48,13.06 arc(3.63,13.41) 3.97,13.55 4.03,13.55 arc(4.37,13.41) 4.52,13.06 4.52,12.41 arc(4.56,12.3) 4.68,12.25 4.74,12.25 arc(4.85,12.3) 4.9,12.41 4.9,13.06 arc(5.04,13.41) 5.39,13.55 5.45,13.55 arc(5.79,13.41) 5.93,13.06 5.93,12.41 arc(5.98,12.3) 6.09,12.25 6.15,12.25 arc(6.27,12.3) 6.31,12.41 arc(6.46,12.76) 6.8,12.9 16.92,12.9 17.01,12.99 17.01,13.15 17.1,13.23 17.3,13.23 17.39,13.15 17.39,12.99 17.48,12.9 17.68,12.9 17.77,12.99 17.77,13.15 17.86,13.23 18.06,13.23 18.15,13.15 18.15,12.99 18.24,12.9 19.01,12.9 19.18,13.07 v1(19.56,13.07)
MIPI_3_N: length 45.5
  Top Layer w0.124: v1(4.19,24.32) 4.57,24.32 4.74,24.16 5.01,24.16 5.03,24.14 5.15,24.14 5.24,24.22 FPC2.8 ; v1(21.21,11.08) 21.69,11.08 24.26,13.64 26.84,13.64 26.88,13.6 T1.64
  Bottom Layer w0.124: v1(4.19,24.32) 3.81,24.32 3.65,24.16 1.65,24.16 0.44,22.94 0.44,12.72 1.91,11.24 20.66,11.24 20.83,11.08 v1(21.21,11.08)
MIPI_3_P: length 45.6
  Top Layer w0.124: T1.63 26.88,14 26.84,13.97 24.12,13.97 21.73,11.57 21.51,11.57 21.34,11.74 v1(21.21,11.74) ; v1(4.19,23.66) 4.57,23.66 4.74,23.83 4.87,23.83 4.89,23.81 5.15,23.81 5.24,23.72 FPC2.9
  Bottom Layer w0.124: v1(21.21,11.74) 20.83,11.74 20.66,11.57 18.22,11.57 18.13,11.66 18.13,11.88 18.05,11.96 17.84,11.96 17.75,11.88 17.75,11.66 17.66,11.57 17.46,11.57 17.37,11.66 17.37,11.88 17.28,11.96 17.08,11.96 16.99,11.88 16.99,11.66 16.9,11.57 2.05,11.57 0.76,12.85 0.76,22.81 1.79,23.83 3.65,23.83 3.81,23.66 v1(4.19,23.66)
MIPI_LCD_RST: length 23
  Top Layer w0.158: T1.54 24.29,17.6 v1(24.12,17.78) 23.7,18.19 22.35,18.19 19.89,15.72 FPC2.25
MIPI_LCD_TE: length 23.2
  Top Layer w0.158: FPC2.24 19.6,16.22 22.2,18.82 24,18.82 v1(24.68,18.15) 24.82,18 T1.53
PA_SHDN: length 23.4
  Top Layer w0.152: v1(52.58,10.06) 52.21,9.69 51.05,9.69 ; T1.86 37.62,11.23 37.34,10.95 v1(37.34,10.57)
  Top Layer w0.381: R138.2 52.07,8.42 U53.1
  Bottom Layer w0.152: v1(37.34,10.57) 37.85,10.06 45.08,10.06 46.74,11.71 51.94,11.71 52.58,11.08 v1(52.58,10.06)
RESET: length 21.7
  Top Layer w0.127: 18.6,33.43 18.6,32.21 R13.1 18.21,31.71 C41.2
  Top Layer w0.152: 18.6,33.43 18.6,34.13 17.15,35.59 17.15,35.81 16.74,36.22 ; C41.2 20.38,31.71 24.26,27.84 27.24,27.84 28.76,26.32 30.86,26.32 31.22,26.68 T1.27
SPI0_CLK: length 12.1
  Top Layer w0.152: U1.6 36.89,35.27 35.68,36.48 34.67,36.48 34.42,36.23 34.42,30.88 34.67,30.63 34.67,29.62 34.42,29.37 T1.19
SPI0_CS: length 16.9
  Top Layer w0.152: T1.18 34.82,29.26 38.51,32.94 v1(38.51,33) ; R122.1 45.47,31.02 45.47,32.13 44.94,32.65 ; v1(44.2,31.9) 44.94,32.65 ; 44.94,32.65 U1.1
  Bottom Layer w0.152: v1(44.2,31.9) 43.69,31.9 42.59,33 v1(38.51,33)
SPI0_HOLD: length 10.2
  Top Layer w0.152: v1(37.85,29.74) 37.72,29.74 36.45,28.47 36.45,27.49 T1.14 ; v1(37.85,33.55) 37.42,33.98 36.89,33.98 36.89,34 R93.1
  Bottom Layer w0.152: v1(37.85,29.74) 37.9,29.8 37.9,33.5 v1(37.85,33.55)
SPI0_MISO: length 13.2
  Top Layer w0.152: 44.94,33.98 43.98,33.98 43.18,33.17 43.18,32.41 42.67,31.9 38.73,31.9 35.62,28.79 T1.16
SPI0_MOSI: length 19.4
  Top Layer w0.152: SW1.1 30.93,36.67 U21.1 32,36.85 32.77,37.62 35.94,37.62 36.89,36.67 U1.5 37.68,36.52 38.99,35.21 38.99,32.79 35.22,29.03 T1.17
SPI0_WP: length 18.6
  Top Layer w0.152: 45.97,34.95 45.97,33.55 45.72,33.3 44.2,33.3 43.69,32.79 43.69,32.16 43.05,31.52 38.86,31.52 36.02,28.68 T1.15 ; 45.97,34.95 45.97,36.34 R145.2 ; 45.97,34.95 45.68,35.25 U1.3
TP_INT: length 15.1
  Top Layer w0.152: 14.93,21.22 16.62,21.22 17.8,22.4 20.25,22.4 ; 20.25,22.4 19.74,22.91 RN1.4 ; 20.25,22.4 T1.42
TP_RST: length 17
  Top Layer w0.152: T1.43 18.17,22 v1(17.53,21.36) ; 17.34,24.02 17.4,23.96 v1(17.4,23.01) ; 14.93,19.72 16.24,19.72 v1(16.26,19.71)
  Bottom Layer w0.152: v1(17.4,23.01) 17.4,21.49 v1(17.53,21.36) 17.02,21.36 16.64,20.98 16.64,20.09 v1(16.26,19.71)
TP_SCL: length 16.4
  Top Layer w0.152: T1.44 18.78,21.6 v1(18.29,21.11) 17.4,20.22 14.93,20.22 ; RN1.2 v1(18.14,23.01)
  Bottom Layer w0.152: v1(18.14,23.01) NOREF#12.TP6 18.14,21.25 v1(18.29,21.11)
TP_SDA: length 17
  Top Layer w0.152: v1(18.92,23.01) 18.94,23.03 18.94,24.02 ; v1(18.69,20.45) 19.44,21.2 T1.45 ; 14.93,20.72 v1(17.15,20.72)
  Bottom Layer w0.152: v1(17.15,20.72) 17.55,20.32 18.56,20.32 v1(18.69,20.45) 18.92,20.68 NOREF#9.TP7 v1(18.92,23.01)
UART0_RX: length 15.5
  Top Layer w0.152: v1(26.42,26.44) 26.86,26 T1.33
  Bottom Layer w0.152: U5.9 22.82,35.54 21.97,34.7 21.97,28.22 23.75,26.44 v1(26.42,26.44)
UART0_TX: length 16.3
  Top Layer w0.152: v1(26.29,24.79) 26.7,25.2 T1.35
  Bottom Layer w0.152: v1(26.29,24.79) 24.77,24.79 21.55,28.01 U5.8
UART1_CTS: length 30.3
  Top Layer w0.152: v1(40.01,28.98) 40.42,28.57 T1.4 ; v1(60.07,34.44) 60.2,34.44 60.71,33.94 60.71,33.17 61.98,31.9 63.23,31.9 63.25,31.93 U11.41
  Bottom Layer w0.152: v1(60.07,34.44) 49.02,34.44 47.24,32.67 47.24,31.14 46.48,30.38 40.89,30.38 40.01,29.49 v1(40.01,28.98)
UART1_RTS: length 28.2
  Top Layer w0.152: T1.3 40.82,28.98 v1(40.69,29.11) ; v1(61.85,34.19) 62.5,34.19 62.94,34.63 U11.44
  Bottom Layer w0.152: v1(61.85,34.19) 61.6,33.94 49.02,33.94 47.75,32.67 47.75,30.51 47.24,30 41.58,30 v1(40.69,29.11)
